# EAGLE design M8-1Wire (EAGLE 9.5.2)
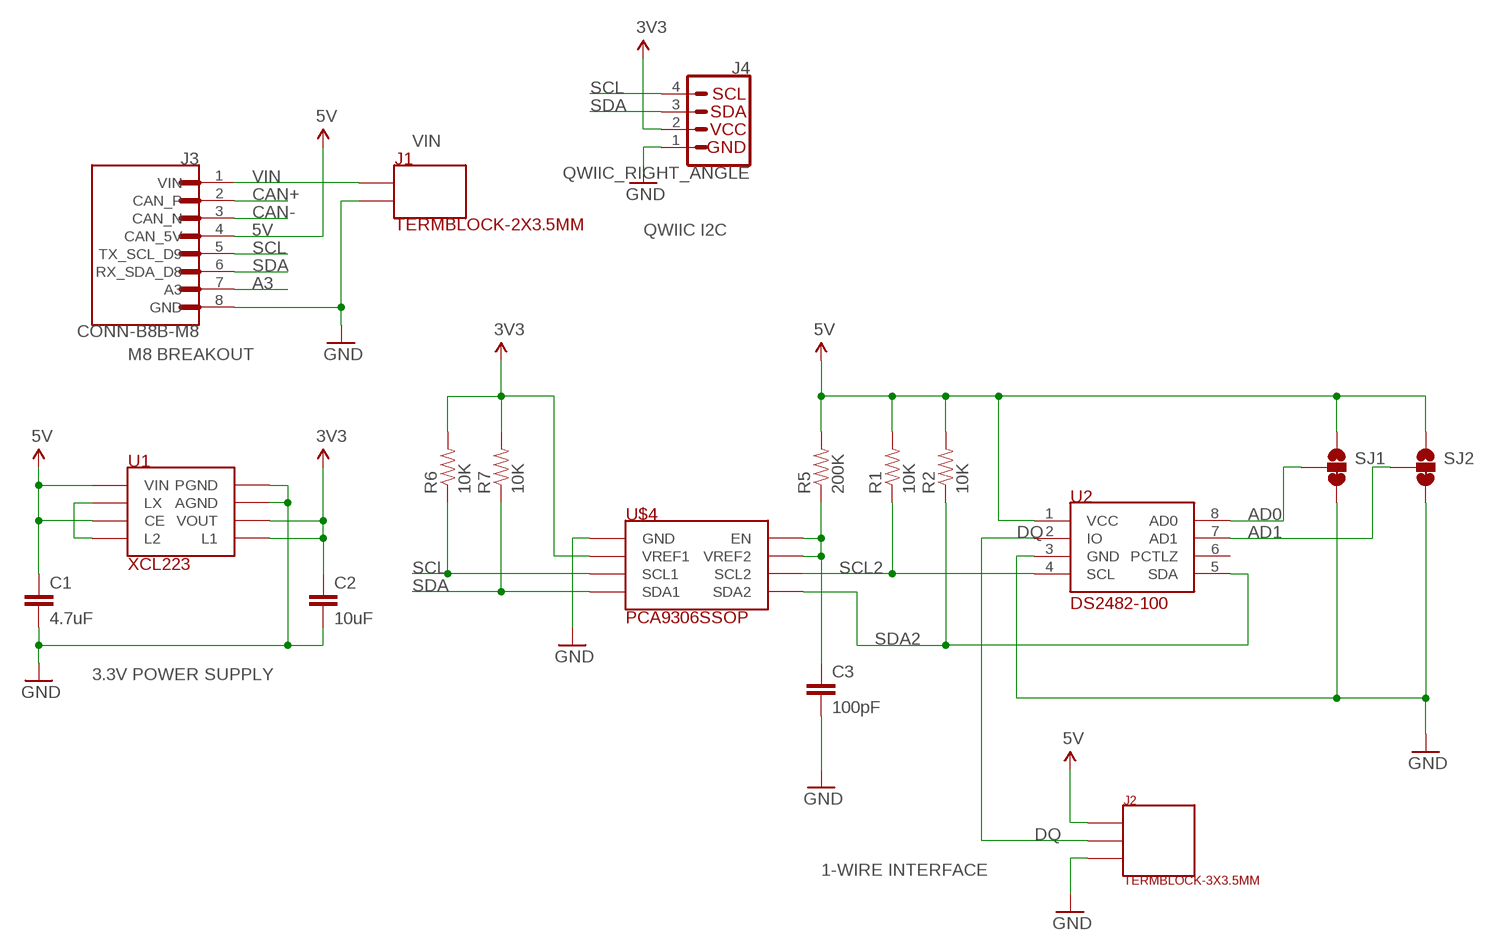
[diagram p0: schematic, sheet 1]

## Parts
C1  4.7uF  CAP-4.7UF-0603  [0603-CAP]
C2  10uF  CAP-10UF-0603  [0603-CAP]
C3  100pF  CAP-100PF-0603  [0603-CAP]
J1  TERMBLOCK-2X3.5MM  [TERMBLOCK-2X3.5MM]
J2  TERMBLOCK-3X3.5MM  [TERMBLOCK-3X3.5MM]
J3  CONN-B8B-M8  [JST_B8B-PH-SM4-TB(LF)(SN)]
J4  QWIIC_RIGHT_ANGLE  QWIIC_CONNECTORJS-1MM  [JST04_1MM_RA]
R1  10K  RES-10K-06030603  [0603-RES]
R2  10K  RES-10K-06030603  [0603-RES]
R5  200K  RES-200K-0603  [0603-RES]
R6  10K  RES-10K-06030603  [0603-RES]
R7  10K  RES-10K-06030603  [0603-RES]
SJ1  JUMPER-PAD-3-2OF3_NC_BY_TRACE_SMALL  [PAD-JUMPER-3-2OF3_NC_BY_TRACE_NO_SILK]
SJ2  JUMPER-PAD-3-2OF3_NC_BY_TRACE_SMALL  [PAD-JUMPER-3-2OF3_NC_BY_TRACE_NO_SILK]
U1  XCL223  REG-XCL223  [REG-XCL223-LESS-CREAM]
U2  DS2482-100  [8-SOIC-MAXIM]
U$4  PCA9306SSOP  [8-SSOP-TI]

## Nets
3V3: C2.1 J4.2 R6.2 R7.2 U1.3(VOUT) U1.7(L1) U$4.2(VREF1)
5V: C1.1 J2.1 J3.4(CAN_5V) R1.2 R2.2 R5.2 SJ1.1 SJ2.1 U1.4(CE) U1.6(VIN) U2.1(VCC)
A3: J3.7(A3)
AD0: SJ1.2 U2.8(AD0)
AD1: SJ2.2 U2.7(AD1)
CAN+: J3.2(CAN_P)
CAN-: J3.3(CAN_N)
DQ: J2.2 U2.2(IO)
GND: C1.2 C2.2 C3.2 J1.2 J2.3 J3.8(GND) J4.1 SJ1.3 SJ2.3 U1.1(PGND) U1.2(AGND) U2.3(GND) U$4.1(GND)
LX: U1.5(LX) U1.8(L2)
SCL: J3.5(TX_SCL_D9) J4.4 R6.1 U$4.3(SCL1)
SCL2: R1.1 U2.4(SCL) U$4.6(SCL2)
SDA: J3.6(RX_SDA_D8) J4.3 R7.1 U$4.4(SDA1)
SDA2: R2.1 U2.5(SDA) U$4.5(SDA2)
VIN: J1.1 J3.1(VIN)
VREF2_EN: C3.1 R5.1 U$4.7(VREF2) U$4.8(EN)
Unconnected: U2.6(PCTLZ)

## Notes on the sheet
- VIN
- QWIIC I2C
- M8 BREAKOUT
- 3.3V POWER SUPPLY
- 1-WIRE INTERFACE

## Library data of the parts
C1 = rickk2:CAP-4.7UF-0603: Murata X5R series CAP CER 4.7UF 6.3V X5R 0603 $0.12 https://www.digikey.com/product-detail/en/murata-electronics-north-america/GRM188R60J475KE19J/490-6407-1-ND/3845604
C2 = rickk2:CAP-10UF-0603: CAP CER 10UF 16V X5R 0805 $ 0.21 https://www.digikey.com/product-detail/en/murata-electronics-north-america/GRM21BR61C106KE15L/490-3886-1-ND/965928
C3 = rickk2:CAP-100PF-0603: CAP 100PF 0603
J1 = rickk2:TERMBLOCK-2X3.5MM: TERM BLK 2POS SIDE ENT 3.5MM PCB $0.67 On Shore Technology Inc. OSTTE020161M https://www.digikey.com/products/en?keywords=ED2635-ND
J2 = rickk2:TERMBLOCK-3X3.5MM: TERM BLOCK 3.5MM VERT 3POS PCB $1.00 3 Position Wire to Board Terminal Block Horizontal with Board 0.138" (3.50mm) Through Hole 10A 16-26 AWG Top screw, vertical, blue https://www.digikey.com/product-detail/en/on-shore-technology-inc/OSTTE030161/ED2636-ND/614585
J3 = rickk2:CONN-B8B-M8: PH Series 2 mm Pitch 12 Position SMT Single Row Top Entry Shrouded Header
J4 = rickk2:QWIIC_CONNECTOR: SparkFun I2C Standard Qwiic Connector An SMD 1mm pitch JST connector makes it easy and quick (get it? Qwiic?) to connect I2C devices to each other. The Qwiic system <http://www.sparkfun.com/qwiic> enables fast and solderless connection between popular platforms and various sensors and actuators. We carry 200mm <https://www.sparkfun.com/products/14204>, 100mm <https://www.sparkfun.com/products/14205>, 50mm <https://www.sparkfun.com/products/14206>, and breadboard friendly <https://www.sparkfun.com/products/14207> Qwiic cables. We also offer 10 pcs strips <https://www.sparkfun.com/products/14323> the SMD connectors.; PROD_ID: CONN-13694
R1 R2 R6 R7 = rickk2:RES-10K-0603: RES SMD 10K OHM 5% 1/4W 0603 $ 0.10 https://www.digikey.com/product-detail/en/panasonic-electronic-components/ERJ-PA3J103V/P10KBZCT-ND/5036237
R5 = rickk2:RES-200K-0603: RES SMD 200K https://www.digikey.com/product-detail/en/panasonic-electronic-components/ERJ-3EKF2003V/P200KHCT-ND/198241
SJ1 SJ2 = rickk2:JUMPER-PAD-3-2OF3_NC_BY_TRACE
U1 = rickk2:REG-XCL223: Manufacturer: Torex Semiconductor Ltd Manufacturer Part Number: XCL223A333D2-G DC DC CONVERTER 3.3V Detailed Description: Non-Isolated PoL Modul $2.63 https://www.digikey.com/product-detail/en/torex-semiconductor-ltd/XCL223A333D2-G/893-1416-1-ND/8256118 CIN=4.7uF 10V CL = 10uF 10V VIN MAX=5.5V VOUT=3.3V
U2 = rickk2:DS2482-100: IC BRIDGE I2C TO 1-WIRE 8-SOIC $1.54 1-Wire® Bridge, 1-Wire® to I²C I²C Interface 8-SOIC https://www.digikey.com/product-detail/en/maxim-integrated/DS2482S-100-/DS2482S-100--ND/1197435
U$4 = rickk2:PCA9306: IC TRNSLTR BIDIRECTIONAL SM8 PCA9306DCTR $0.67 https://www.digikey.com/product-detail/en/texas-instruments/PCA9306DCTR/296-18509-1-ND/809938 VREF1=3.3V VREF2=5V connect w/200K res and 100 pF cap to GND Use 8-SSOP version!

## Board
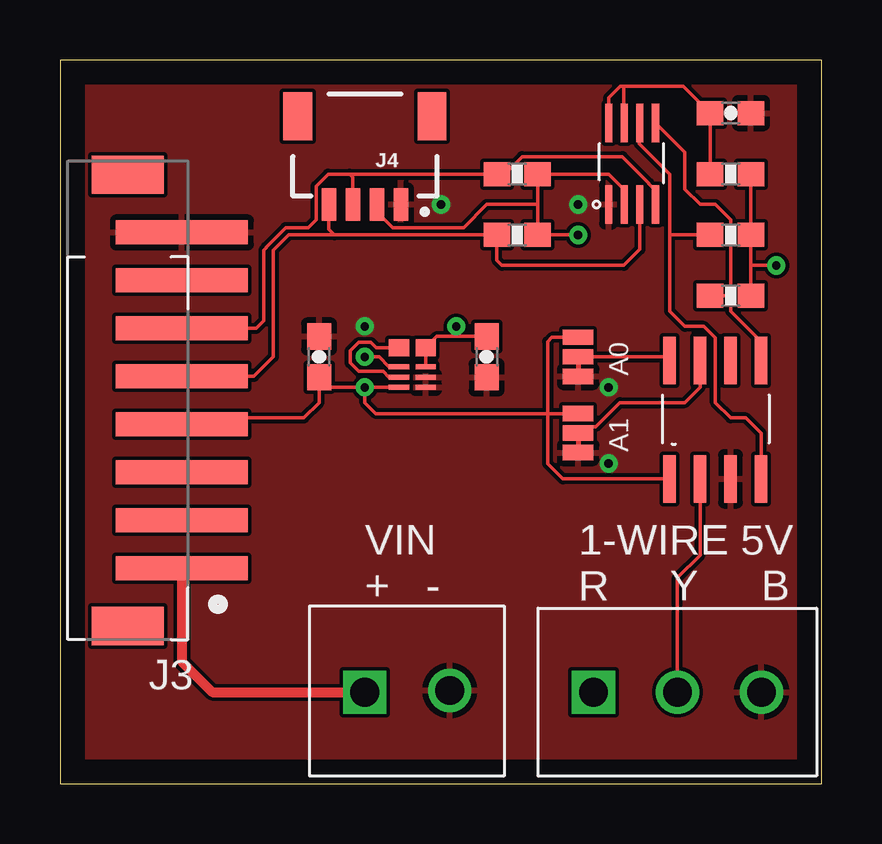
[diagram p1: board, top side]
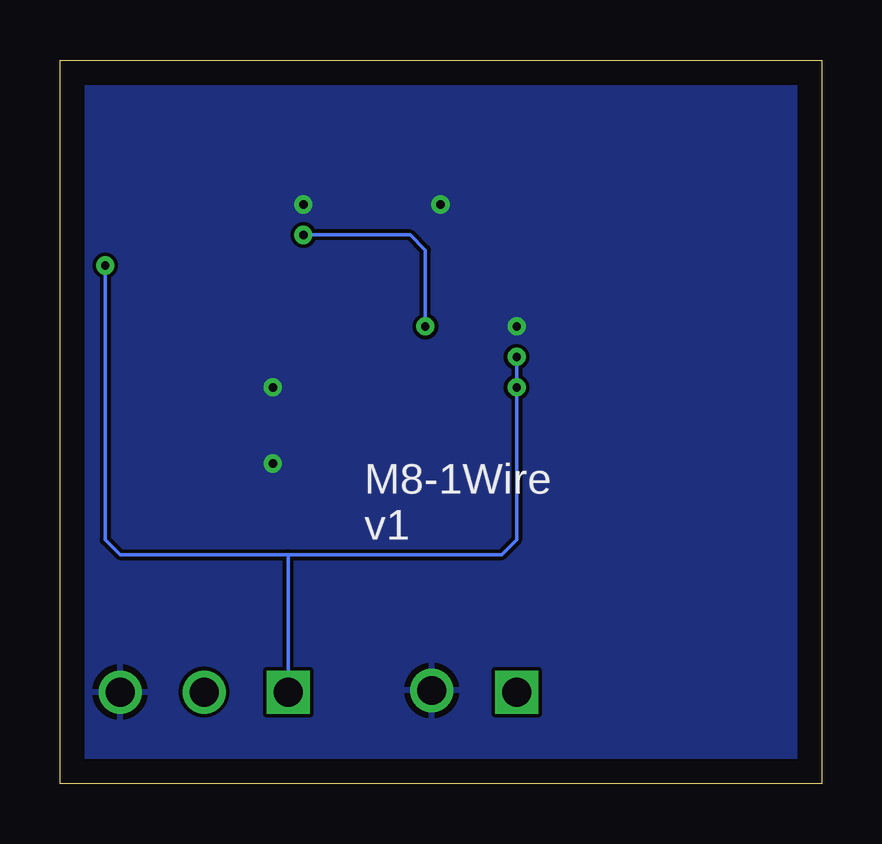
[diagram p2: board, bottom side, seen from below]

Size 31.73 x 30.15 mm. Coordinates in mm from the lower left corner, seen from the top.
Outline: 0,0 31.73,0 31.73,30.15 0,30.15 0,0
Copper layers (1*16): Top 0.035mm / dielectric 1.5mm / Bottom 0.035mm
Design rules "default": minimum track width 6mil, minimum drill 0.35mm, track to track 6mil, track to pad 6mil, pad to pad 6mil, via to via 6mil, smd to smd 6mil, copper to edge 40mil, drill to drill 6mil, minimum pad ring 10mil, minimum via ring 8mil, stop-mask expansion 4mil, vias tented up to drill 0mil, thermal gap 10mil

### Footprints (pad centres in the part's own frame; a part is rotated, then mirrored left to right if it is on the bottom)
0603-CAP = smd 1.1 x 1: 1 -0.85,0; 2 0.85,0
TERMBLOCK-2X3.5MM = drill 1.2 square: 1 0,0 | drill 1.2: 2 3.54,0.07
TERMBLOCK-3X3.5MM = drill 1.2 square: 1 0,0 | drill 1.2: 2 3.5,0; 3 7,0
JST_B8B-PH-SM4-TB(LF)(SN) = smd 1 x 5.5: 1 -5,0; 2 -3,0; 3 -1,0; 4 1,0; 5 3,0; 6 5,0; 7 7,0; 8 9,0 | smd 1.6 x 3: P1 -7.4,2.25; P2 11.4,2.25
JST04_1MM_RA = smd 0.6 x 1.35: 1 -1.5,0; 2 -0.5,0; 3 0.5,0; 4 1.5,0 | smd 1.2 x 2: NC1 2.8,-3.675; NC2 -2.8,-3.675
0603-RES = smd 1.1 x 1: 1 -0.85,0; 2 0.85,0
PAD-JUMPER-3-2OF3_NC_BY_TRACE_NO_SILK = smd 0.635 x 1.27: 1 -0.813,0; 2 0,0; 3 0.813,0
REG-XCL223-LESS-CREAM = smd 0.85 x 0.21: 1 0,0; 2 0,0.43; 3 0,0.86; 4 -1.11,0.86; 5 -1.11,0.43; 6 -1.11,0 | smd 0.85 x 0.7: 7 0,1.655; 8 -1.11,1.655
8-SOIC-MAXIM = smd 0.53 x 1.98: 1 0,0; 2 1.27,0; 3 2.54,0; 4 3.81,0; 5 3.81,4.93; 6 2.54,4.93; 7 1.27,4.93; 8 0,4.93
8-SSOP-TI = smd 0.3 x 1.6: 1 0,0; 2 0.65,0; 3 1.3,0; 4 1.95,0; 5 1.95,3.4; 6 1.3,3.4; 7 0.65,3.4; 8 0,3.4

### Placement (x,y rotation side)
C1  10.79,17.78 90 top
C2  17.78,17.78 270 top
C3  27.94,27.94 0 top
J1  12.7,3.81 0 top
J2  22.23,3.81 0 top
J3  5.08,13.97 90 top
J4  12.7,24.13 180 top
R1  27.94,22.86 0 top
R2  27.94,20.32 0 top
R5  27.94,25.4 0 top
R6  19.05,22.86 0 top
R7  19.05,25.4 0 top
SJ1  21.59,17.78 270 top
SJ2  21.59,14.61 270 top
U1  15.24,16.51 0 top
U2  25.4,12.7 0 top
U$4  22.86,24.13 0 top

### Tracks (layer width: path | path; a pad name or v marks a point on that pad's centre or on a via)
3V3  (via drill 0.35)
  Top 0.152: U1.3 U1.7 15.71,18.63 16.51,18.63 | U$4.2 23.51,24.75 22.86,25.4 R7.2 19.9,24.13 | 16.51,18.63 C2.1 | v16.51,19.05 16.51,18.63 | J4.2 13.2,23.83 13.87,23.16 16.82,23.16 17.78,24.13 19.9,24.13 | 19.9,24.13 R6.2 v21.59,22.86
  Bottom 0.152: v21.59,22.86 17.14,22.86 16.51,22.23 v16.51,19.05
5V  (via drill 0.35)
  Top 0.152: U1.4 13.71,17.37 13.3,17.78 v12.7,17.78 | U1.6 v12.7,16.51 | v12.7,16.51 11.21,16.51 C1.1 10.79,15.88 10.16,15.24 5.35,15.24 J3.4 | R2.2 28.79,21.59 | 28.79,21.59 R1.2 R5.2 | 28.79,21.59 v29.84,21.59 | SJ2.1 20.32,15.42 | 20.32,15.42 13.16,15.42 12.7,15.88 v12.7,16.51 | SJ1.1 20.5,18.59 20.32,18.41 20.32,15.42 | U2.1 20.95,12.7 20.32,13.34 20.32,15.42
  Bottom 0.152: v12.7,17.78 v12.7,16.51 12.7,10.16 13.32,9.54 22.23,9.54 | v29.84,21.59 29.84,10.16 29.23,9.54 22.23,9.54 | J2.1 22.23,9.54
AD0
  Top 0.152: SJ1.2 25.25,17.78 U2.8
AD1
  Top 0.152: SJ2.2 21.86,14.87 22.32,14.87 23.32,15.88 26.04,15.88 26.67,16.51 U2.7
DQ
  Top 0.152: J2.2 25.73,8.58 26.67,9.53 U2.2
GND  (via drill 0.35)
  other vias: 21.59,24.13 22.86,16.51 22.86,13.34 15.88,24.13 12.7,19.05
  pour Top: 0,0 0,31.75 40.64,31.75 40.64,0
  pour Bottom: 0,0 0,31.75 41.91,31.75 41.91,0
LX
  Top 0.152: U1.8 13.17,18.16 12.95,18.39 12.45,18.39 12.09,18.03 12.09,17.53 12.45,17.17 13.47,17.17 13.71,16.94 U1.5
SCL
  Top 0.152: 11.43,22.86 R6.1 18.2,21.8 18.41,21.59 23.5,21.59 24.16,22.25 U$4.3 | J4.4 11.2,23.09 11.43,22.86 | J3.5 8.08,16.97 8.89,17.78 8.89,22.23 9.53,22.86 11.43,22.86
SCL2
  Top 0.152: U2.4 29.21,14.61 28.57,15.24 27.94,15.24 27.3,15.88 27.3,18.57 26.83,19.05 26.04,19.05 25.4,19.68 25.4,22.86 | 25.4,22.86 25.4,25.4 24.13,26.67 24.13,27.5 U$4.6 | R1.1 25.4,22.86
SDA
  Top 0.152: 12.06,25.4 R7.1 18.53,25.4 19.25,26.13 23.43,26.13 24.54,25.02 24.54,24.99 24.81,24.72 U$4.4 | J4.3 12.2,25.27 12.06,25.4 | J3.6 8.18,18.97 8.49,19.29 8.49,22.23 8.59,22.32 8.59,22.35 9.4,23.16 10.34,23.16 10.67,23.5 10.67,24.9 11.17,25.4 12.06,25.4
SDA2
  Top 0.152: U$4.5 26.04,26.3 26.04,24.77 26.67,24.13 27.3,24.13 27.94,23.5 27.94,20.32 | 27.94,20.32 27.94,19.68 29.21,18.41 U2.5 | R2.1 27.94,20.32
VIN
  Top 0.406: J3.1 5.08,5.08 6.35,3.81 J1.1
VREF2_EN
  Top 0.152: R5.1 C3.1 25.97,29.06 23.5,29.06 | U$4.8 22.86,28.57 23.34,29.06 23.5,29.06 | U$4.7 23.5,27.55 23.5,29.06

### Text on the board
tPlace: A0 | A1 | VIN | 1-WIRE 5V | + | - | R | Y | B
bPlace: M8-1Wire / v1